# EAGLE design esploc (EAGLE 7.0.0)
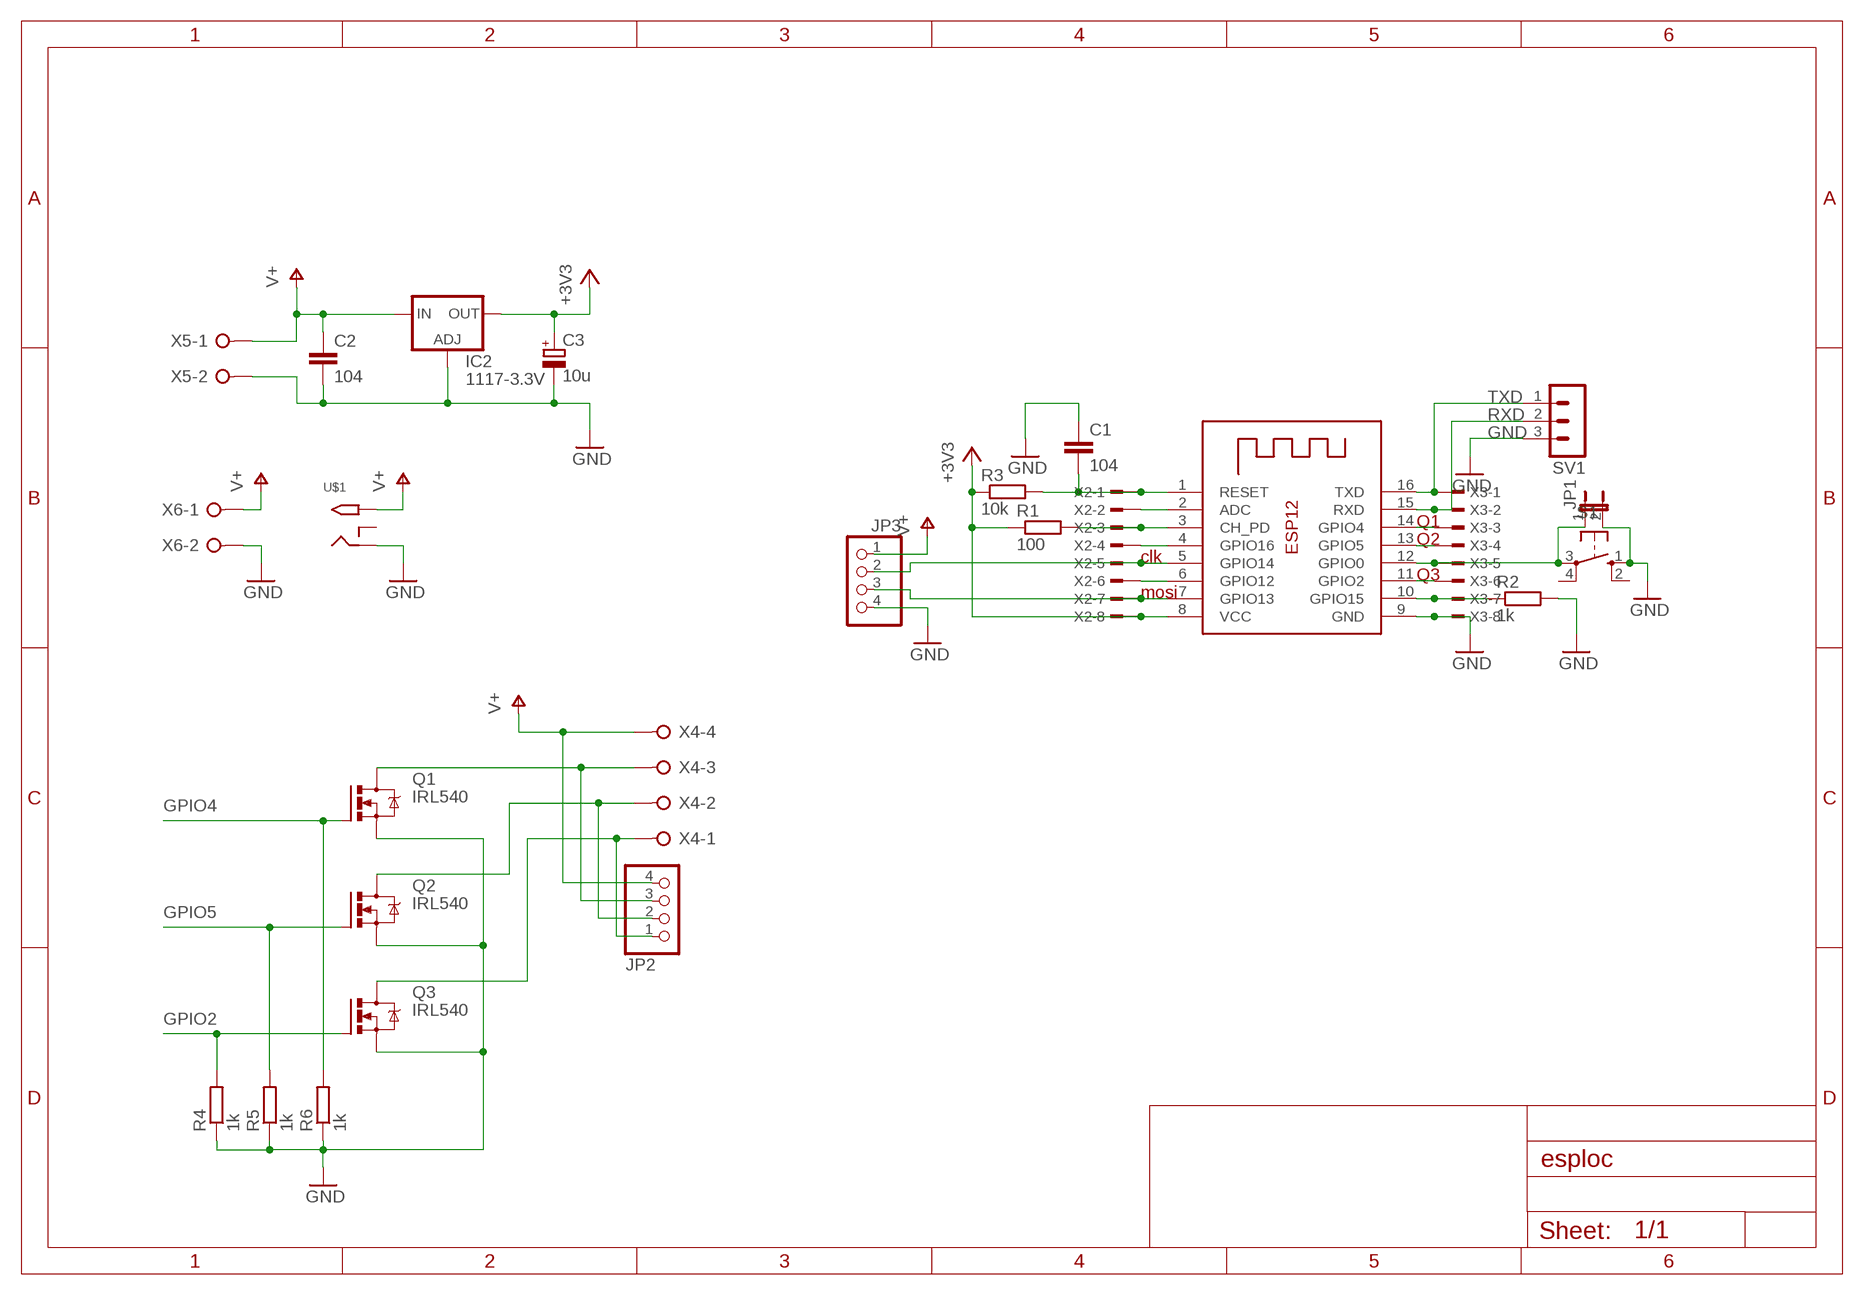
[diagram p0: schematic, sheet 1]

## Parts
C1  104  C-EU025_050-025X075  [C025_050-025X075]
C2  104  C-EU025_050-025X075  [C025_050-025X075]
C3  10u  CPOL-EUE2,5-6E  [E2,5-6E]
IC2  1117-3.3V  LD117AS33TR  [SOT223]
JP1  JP1E  [JP1]
JP2  PINHD-1X4  [1X04]
JP3  PINHD-1X4  [1X04]
Q1  IRL540  IRF540  [TO220BV]
Q2  IRL540  IRF540  [TO220BV]
Q3  IRL540  IRF540  [TO220BV]
R1  100  R-EU_M0805  [M0805]
R2  1k  R-EU_M0805  [M0805]
R3  10k  R-EU_M0805  [M0805]
R4  1k  R-EU_M0805  [M0805]
R5  1k  R-EU_M0805  [M0805]
R6  1k  R-EU_M0805  [M0805]
S1  40-XX  [B3F-40XX]
SV1  MA03-1  [MA03-1]
U$1  2.1MMJACKTHM  [PJ-102A]
X1  ESP-12  [ESP-12]
X2  TSW-108-02-S-S  [TSW-108-02-S-S]
X3  TSW-108-02-S-S  [TSW-108-02-S-S]
X4  W237-04P  [W237-4P]
X5  W237-02P  [W237-132]
X6  W237-02P  [W237-132]

## Nets
+3V3: C3.+ IC2.2(OUT) IC2.4(OUT) R1.1 R3.1 X1.8(VCC) X2.8
GND: C1.1 C2.2 C3.- IC2.1(ADJ) JP1.2 JP3.4 Q1.S Q2.S Q3.S R2.2 R4.1 R5.1 R6.1 S1.1(S) SV1.3 U$1.RING X1.9(GND) X3.8 X5.2 X6.2
GPIO2: Q3.G R4.2 X1.11(GPIO2) X3.6
GPIO4: Q1.G R6.2 X1.14(GPIO4) X3.3
GPIO5: Q2.G R5.2 X1.13(GPIO5) X3.4
GPIO12: X1.6(GPIO12) X2.6
GPIO13: JP3.3 X1.7(GPIO13) X2.7
GPIO14: JP3.2 X1.5(GPIO14) X2.5
N$2: C1.2 R3.2 X1.1(RESET) X2.1
N$3: R1.2 X1.3(CH_PD) X2.3
N$4: R2.1 X1.10(GPIO15) X3.7
N$6: X1.4(GPIO16) X2.4
N$9: JP1.1 S1.3(P) X1.12(GPIO0) X3.5
N$10: X1.2(ADC) X2.2
N$18: JP2.3 Q1.D X4.3
N$19: JP2.2 Q2.D X4.2
N$20: JP2.1 Q3.D X4.1
RXD: SV1.2 X1.15(RXD) X3.2
TXD: SV1.1 X1.16(TXD) X3.1
V+: C2.1 IC2.3(IN) JP2.4 JP3.1 U$1.TIP X4.4 X5.1 X6.1
Unconnected: S1.2(S1) S1.4(P1) U$1.RING_SW

## Notes on the sheet
- Q1
- Q2
- clk
- Q3
- mosi

## Library data of the parts
C1 C2 = rcl:C-EU: CAPACITOR, European symbol
C3 = rcl:CPOL-EU: POLARIZED CAPACITOR, European symbol
IC2 = v-reg:LD117A?*: Low drop fixed and adjustable positive voltage regulators 1 A Source: http://www.st.com/stonline/products/literature/ds/7194/ld1117axx.pdf
JP1 = jumper:JP1E: JUMPER
JP2 JP3 = pinhead:PINHD-1X4: PIN HEADER
Q1-Q3 = transistor-power:IRF540: HEXFET Power MOSFET
R1-R6 = rcl:R-EU_: RESISTOR, European symbol
S1 = switch-omron:40-XX: OMRON SWITCH; MF: OMRON COMPONENTS USA; MPN: B3F-4000; OC_FARNELL: 176434; OC_NEWARK: 36K3105
SV1 = con-lstb:MA03-1: PIN HEADER; OC_FARNELL: unknown; OC_NEWARK: unknown
U$1 = adafruit:2.1MMJACK: 2.1mm x 5.5mm THM DC jack with internal switch. Digikey part #PJ-102A, 4UCON part #05537 2.1mm x 5.5mm SMT DC jack with internal switch. Digikey part #PJ-002A-SMT, 4UCON part #03267 By microbuilder.eu & adafruit.com
X1 = adafruit:ESP-12
X2 X3 = con-samtec:TSW-108-02-S-S: THROUGH-HOLE .025" SQ POST HEADER Source: Samtec TSW.pdf; OC_FARNELL: unknown; OC_NEWARK: unknown
X4 = con-wago-508:W237-04P: WAGO SREW CLAMP; OC_FARNELL: unknown; OC_NEWARK: unknown
X5 X6 = con-wago-508:W237-02P: WAGO SREW CLAMP; OC_FARNELL: unknown; OC_NEWARK: unknown

## Board
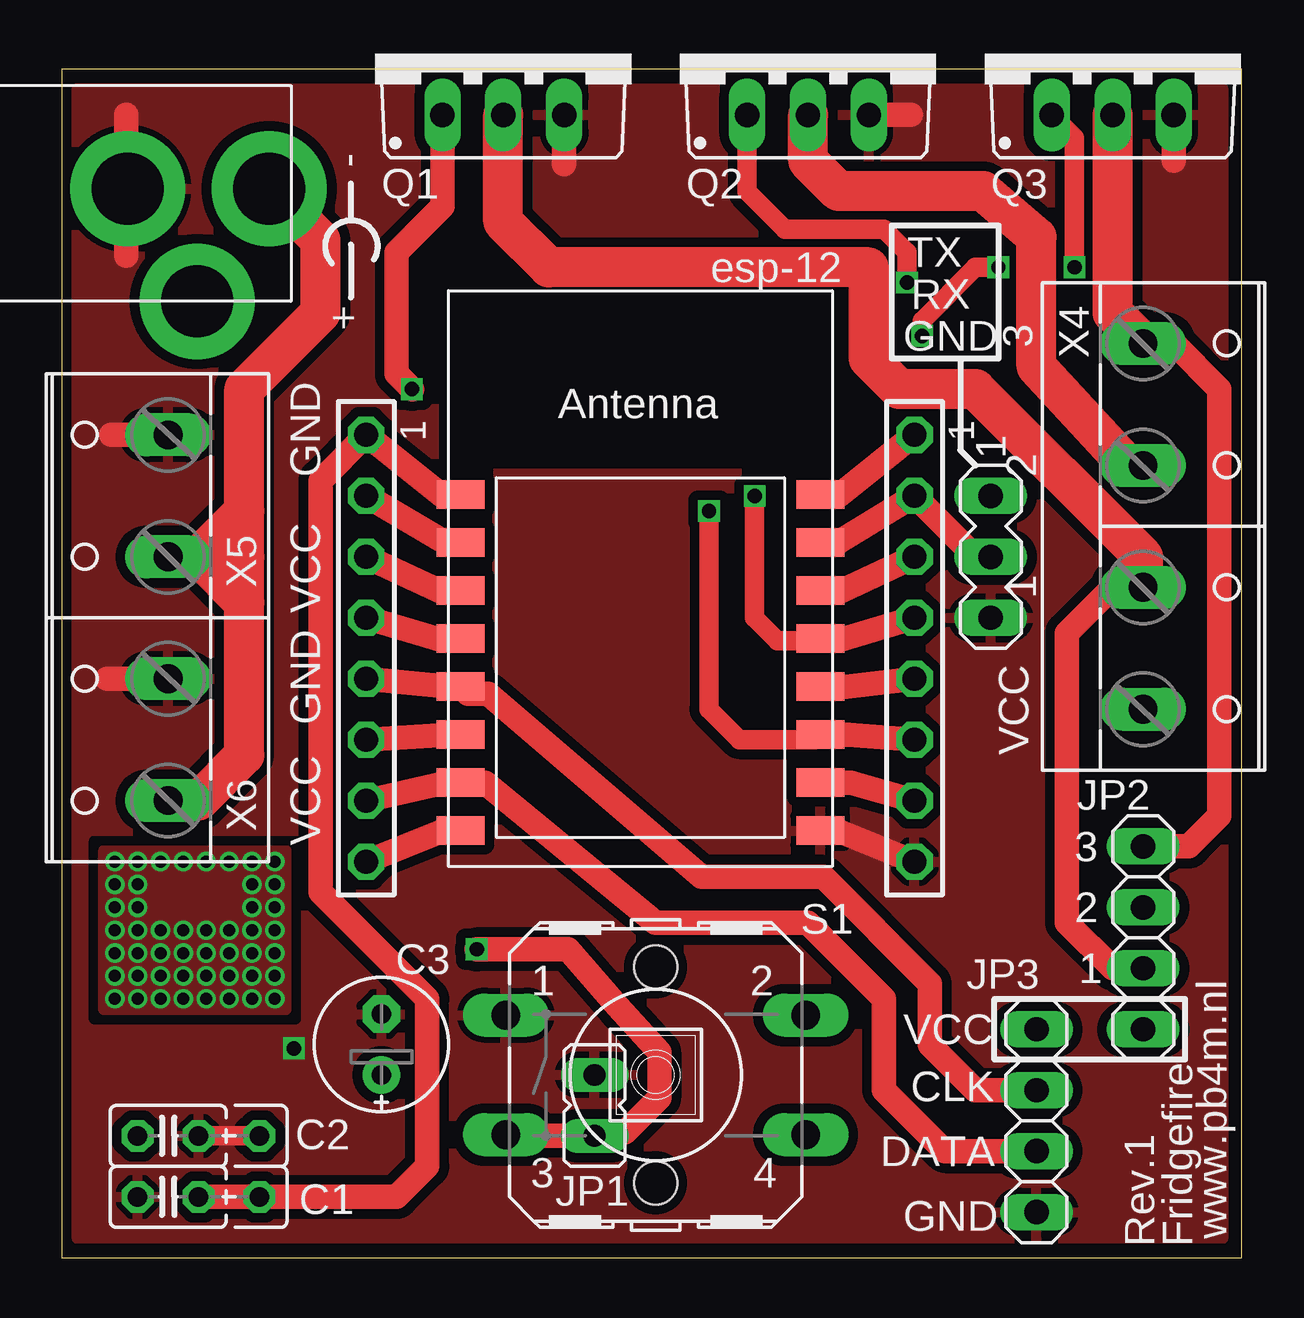
[diagram p1: board, top side]
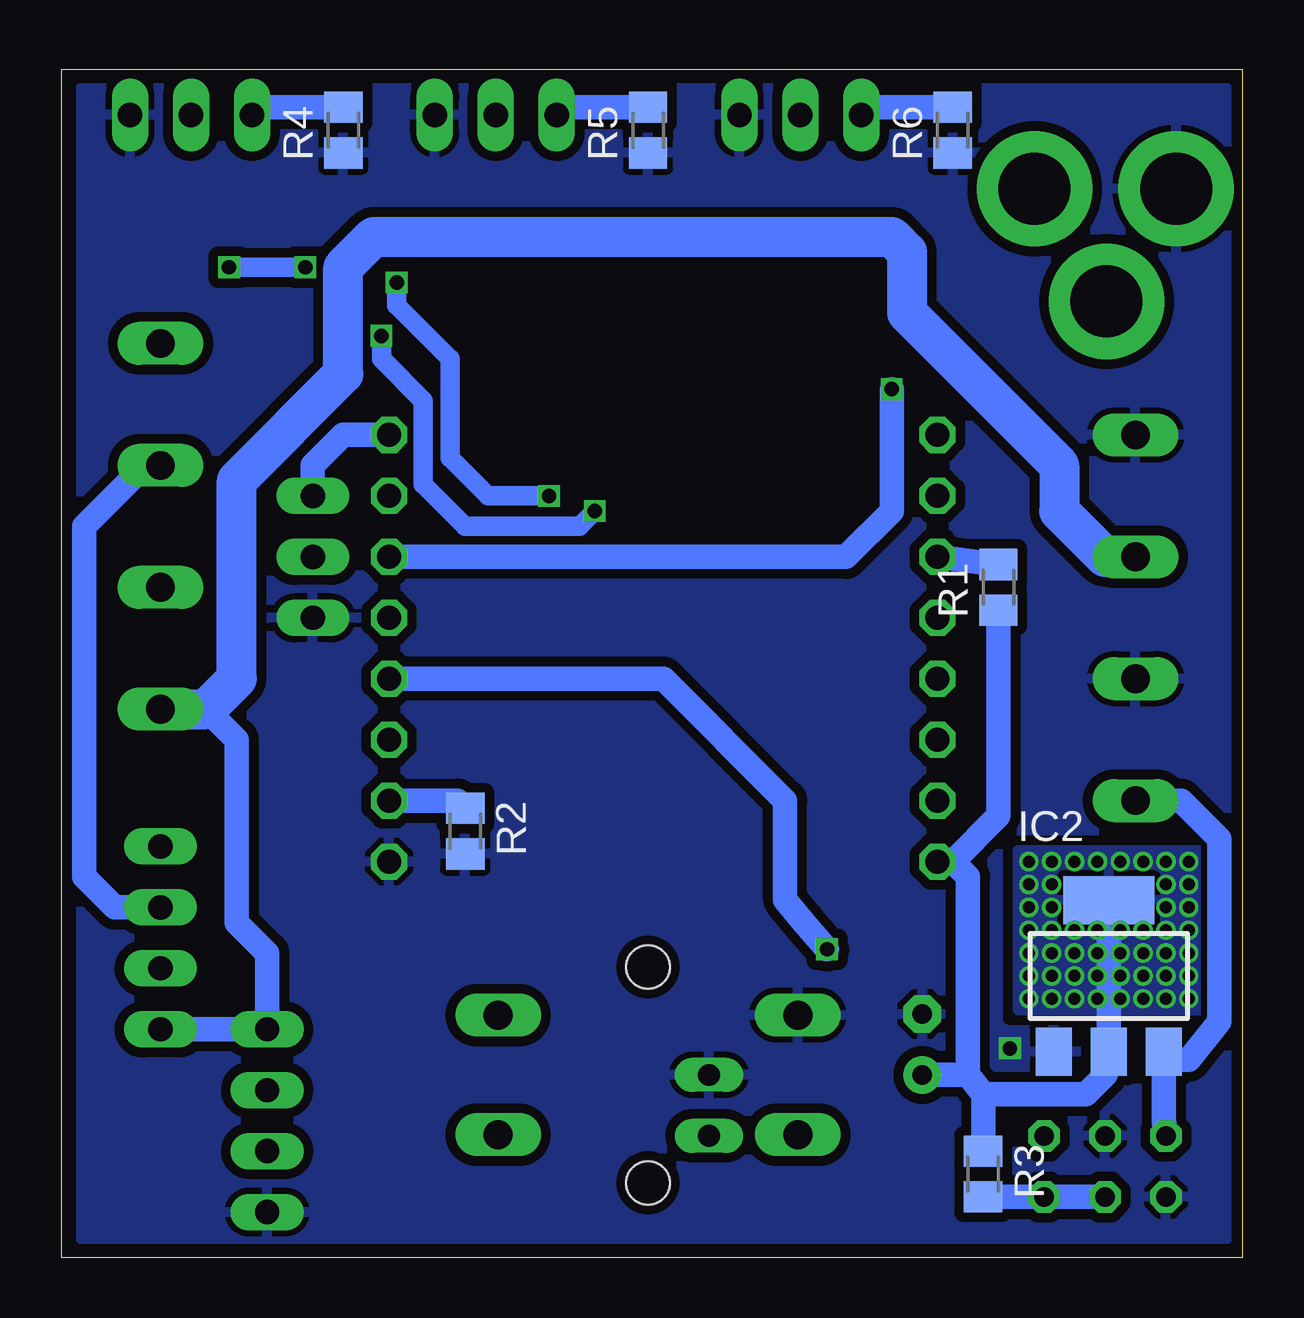
[diagram p2: board, bottom side, seen from below]

Size 49.2 x 49.52 mm. Coordinates in mm from the lower left corner, seen from the top.
Outline: 0,0 49.2,0 49.2,49.52 0,49.52 0,0
Copper layers (1*16): Top 0.035mm / dielectric 1.5mm / Bottom 0.035mm
Design rules "SeeedStudio_2layer_DRU_no_angle_20140221 *": minimum track width 6mil, minimum drill 12mil, track to track 6mil, track to pad 6mil, pad to pad 6mil, via to via 6mil, smd to smd 0mil, copper to edge 10mil, drill to drill 10mil, minimum pad ring 10mil, minimum via ring 6mil, stop-mask expansion 2mil, vias tented up to drill 100mil, thermal gap 10mil

### Footprints (pad centres in the part's own frame; a part is rotated, then mirrored left to right if it is on the bottom)
C025_050-025X075 = drill 0.813 octagon: 1 -1.27,0; 2 1.27,0; 3 3.81,0
E2,5-6E = drill 0.813 pad 1.575: + -1.27,0 | drill 0.813 pad 1.575 octagon: - 1.27,0
SOT223 = smd 1.5 x 2: 1 -2.3,-3.15; 2 0,-3.15; 3 2.3,-3.15 | smd 3.8 x 2: 4 0,3.15
JP1 = drill 0.914 long: 1 0,-1.27; 2 0,1.27
1X04 = drill 1.016 long: 1 -3.81,0; 2 -1.27,0; 3 1.27,0; 4 3.81,0
TO220BV = drill 1.016 long: D 0,-2.54; G -2.54,-2.54; S 2.54,-2.54
M0805 = smd 1.3 x 1.6: 1 -0.95,0; 2 0.95,0
B3F-40XX = drill 1.194 long: 1 -6.248,2.489; 2 6.248,2.489; 3 -6.248,-2.489; 4 6.248,-2.489 | hole 1.803: 0,-4.496; 0,4.496
MA03-1 = drill 1.016 long: 1 -2.54,0; 2 0,0; 3 2.54,0
PJ-102A = drill 3 pad 4.8: RING 0.1,-3.39; RING_SW -4.6,-6.29; TIP 0.1,-9.29
ESP-12 = smd 2 x 1.2: 1 -7.5,4.5; 2 -7.5,2.5; 3 -7.5,0.5; 4 -7.5,-1.5; 5 -7.5,-3.5; 6 -7.5,-5.5; 7 -7.5,-7.5; 8 -7.5,-9.5; 9 7.5,-9.5; 10 7.5,-7.5; 11 7.5,-5.5; 12 7.5,-3.5; 13 7.5,-1.5; 14 7.5,0.5; 15 7.5,2.5; 16 7.5,4.5
TSW-108-02-S-S = drill 1 pad 1.5 octagon: 1 8.89,0; 2 6.35,0; 3 3.81,0; 4 1.27,0; 5 -1.27,0; 6 -3.81,0; 7 -6.35,0; 8 -8.89,0
W237-4P = drill 1.194 long: 1 -7.62,-0.635; 2 -2.54,-0.635; 3 2.54,-0.635; 4 7.62,-0.635
W237-132 = drill 1.194 long: 1 -2.54,-0.635; 2 2.54,-0.635

### Placement (x,y rotation side)
C1  4.45,2.54 0 top
C2  4.45,5.08 0 top
C3  13.34,8.89 90 top
IC2  5.56,11.75 0 bottom
JP1  22.23,6.35 0 top
JP2  45.09,13.34 270 top
JP3  40.64,5.71 270 top
Q1  18.41,50.16 0 top
Q2  31.11,50.16 0 top
Q3  43.81,50.16 0 top
R1  10.16,27.94 90 bottom
R2  32.38,17.78 270 bottom
R3  10.79,3.49 270 bottom
R4  37.47,46.99 90 bottom
R5  24.77,46.99 90 bottom
R6  12.06,46.99 90 bottom
S1  24.77,7.62 0 top
SV1  38.73,29.21 270 top
U$1  -0.64,44.45 90 top
X1  24.13,27.3 0 top
X2  12.7,25.4 90 top
X3  35.56,25.4 90 top
X4  45.72,30.48 270 top
X5  3.81,31.75 90 top
X6  3.81,21.59 90 top

### Tracks (layer width: path | path; a pad name or v marks a point on that pad's centre or on a via)
+3V3  (via drill 0.5)
  Top 1.016: X1.8 15.9,17.8 X2.8
  Bottom 1.016: R1.1 10.16,18.41 12.06,16.51 | 12.06,16.51 X2.8 | R3.1 10.79,6.83 | 10.79,6.83 11.43,7.62 | 11.43,7.62 C3.+ | 10.79,6.83 6.51,6.83 5.69,7.64 5.71,7.67 IC2.2 IC2.4 | 11.43,7.62 11.43,15.88 12.06,16.51
  other vias: 2.22,16.51 3.17,16.51 4.13,16.51 5.08,16.51 6.03,16.51 6.99,16.51 7.94,16.51 8.89,16.51 8.89,15.56 7.94,15.56 3.17,15.56 2.22,15.56 2.22,14.61 3.17,14.61 7.94,14.61 8.89,14.61 8.89,13.65 7.94,13.65 6.99,13.65 6.03,13.65 5.08,13.65 4.13,13.65 3.17,13.65 2.22,13.65 2.22,12.7 3.17,12.7 4.13,12.7 5.08,12.7 6.03,12.7 6.99,12.7 7.94,12.7 8.89,12.7 8.89,11.75 7.94,11.75 6.99,11.75 6.03,11.75 5.08,11.75 4.13,11.75 3.17,11.75 2.22,11.75 2.22,10.79 3.17,10.79 4.13,10.79 5.08,10.79 6.03,10.79 6.99,10.79 7.94,10.79 8.89,10.79
  pour Bottom (isolate 0.254): 1.75,16.99 9.37,16.99 9.37,10.32 1.75,10.32
  pour Top (isolate 0.254): 1.75,16.99 9.37,16.99 9.37,10.32 1.75,10.32
GND  (via drill 0.6)
  Top 0.813: C2.2 8.26,5.08
  Top 1.016: X1.9 32.36,17.8 X3.8 | Q3.S 46.35,45.72 | Q2.S 35.4,47.62 | Q1.S 20.95,45.56 | X5.2 2.06,34.29 | X6.2 1.91,24.13 | 2.7,47.62 2.7,41.75
  other vias: 9.68,8.73
  pour Top (isolate 0.406, rank 6): 0.64,48.74 48.42,48.74 48.42,0.79 0.64,0.79
  pour Bottom (isolate 0.406, rank 6): 0.64,48.74 48.42,48.74 48.42,0.79 0.64,0.79
GPIO2  (via drill 0.6)
  Top 0.813: Q3.G 42.23,46.67 v42.23,41.27 | v39.05,41.27 38.1,41.27 35.88,39.05 v35.88,38.42 | v26.99,31.11 26.99,22.86 28.26,21.59 31.41,21.59 X1.11
  Top 1.016: X1.11 32.8,21.8 X3.6
  Bottom 0.813: v42.23,41.27 v39.05,41.27 | v35.88,38.42 35.88,37.47 34.13,35.72 34.13,32.23 32.38,30.48 27.62,30.48 v26.99,31.11
  Bottom 1.016: R4.2 40.96,47.94 Q3.G
GPIO4  (via drill 0.6)
  Top 1.016: X1.14 32.52,27.8 X3.3 | Q1.G 15.88,43.81 13.97,41.91 13.97,36.83 v14.61,36.2
  Bottom 1.016: R6.2 15.56,47.94 Q1.G | v14.61,36.2 14.61,31.11 16.51,29.21 X3.3
GPIO5  (via drill 0.6)
  Top 0.813: Q2.G 28.57,44.45 30.16,42.86 34.29,42.86 35.24,41.91 v35.24,40.64 | v28.89,31.75 28.89,26.67 29.84,25.72 31.54,25.72 X1.13
  Top 1.016: X1.13 32.62,25.8 X3.4
  Bottom 0.813: v35.24,40.64 35.24,39.69 33.02,37.47 33.02,33.34 31.43,31.75 v28.89,31.75
  Bottom 1.016: R5.2 28.26,47.95 Q2.G
GPIO12
  Top 1.016: X1.6 16.09,21.8 X2.6
GPIO13
  Top 1.016: X2.7 15.99,19.8 X1.7 17.66,19.8 24.77,13.97 31.11,13.97 34.29,10.79 34.29,6.99 36.83,4.45 JP3.3
GPIO14
  Top 1.016: X2.5 16.18,23.8 X1.5 16.94,23.5 17.78,23.5 26.67,15.88 31.75,15.88 36.2,11.43 36.2,8.89 38.1,6.99 JP3.2
N$2
  Top 1.016: X1.1 15.82,31.8 X2.1 10.79,32.38 10.79,15.24 15.24,10.79 15.24,3.81 13.97,2.54 C1.2
  Bottom 1.016: R3.2 8.57,2.54 7.94,2.54 C1.2
N$3
  Top 1.016: X1.3 15.74,27.8 X2.3
  Bottom 1.016: X2.3 R1.2
N$4
  Top 1.016: X1.10 32.9,19.8 X3.7
  Bottom 1.016: X3.7 32.7,19.05 R2.1
N$6
  Top 1.016: X1.4 15.64,25.8 X2.4
N$9  (via drill 0.6)
  Top 1.016: X1.12 32.71,23.8 X3.5 | v17.3,12.86 21.11,12.86 23.18,10.48 24.92,8.57 24.92,6.67 23.5,5.24 22.38,5.24 JP1.1 18.57,5.08 S1.3
  Bottom 1.016: v17.3,12.86 18.26,13.97 19.05,14.92 19.05,19.05 24.13,24.13 X3.5
N$10
  Top 1.016: X2.2 15.96,29.84 X1.2
N$18
  Top 1.016: X4.3 43.81,27.94 41.91,26.04 41.91,13.97 43.81,12.06 JP2.3
  Top 1.676: X4.3 45.09,29.21 38.1,36.2 34.92,36.2 33.66,37.47 33.66,41.27 20.32,41.27 18.41,43.18 Q1.D
N$19
  Top 1.676: Q2.D 31.11,45.72 32.38,44.45 38.42,44.45 40.64,42.55 40.64,37.15 44.45,33.02 X4.2
  Bottom 1.016: 45.72,33.02 48.26,30.48 48.26,15.88 46.99,14.61 JP2.2
  Bottom 1.676: 45.72,33.02 X4.2
N$20
  Top 1.016: X4.1 46.35,38.1 48.26,36.2 48.26,18.41 46.99,17.14 JP2.1
  Top 1.676: X4.1 43.81,39.37 Q3.D
RXD
  Top 1.016: X1.15 32.34,29.8 X3.2 38.1,29.21 SV1.2
TXD
  Top 1.016: X1.16 32.44,31.8 X3.1
  Bottom 1.016: SV1.1 38.73,33.02 37.47,34.29 X3.1
V+
  Top 1.676: X6.1 5.71,19.05 7.62,20.95 7.62,27.3 | 7.62,27.3 7.62,29.21 | 7.62,29.21 7.62,31.11 | 7.62,31.11 7.62,36.2 10.79,39.37 10.79,42.41 U$1.TIP | X5.1 5.71,29.21 | 5.71,29.21 7.62,29.21 | 7.62,31.11 5.71,29.21 | 5.71,29.21 7.62,27.3
  Bottom 1.016: X6.1 2.54,19.05 0.95,17.46 0.95,9.84 2.22,8.26 3.38,8.26 3.42,8.29 IC2.3 3.26,5.64 3.25,5.63 C2.1 | 43.18,22.86 41.91,21.59 41.91,13.97 40.64,12.7 JP3.1 JP2.4
  Bottom 1.676: X4.4 43.18,22.86 41.91,24.13 41.91,32.38 37.47,36.83 37.47,41.27 36.2,42.55 14.61,42.55 13.97,41.91 13.97,39.37 7.62,33.02 7.62,31.11 5.71,29.21 X5.1

### Text on the board
tNames: - | esp-12 | TX | + | RX | GND | 3 | GND | 2 | VCC | 1 | GND | VCC | VCC | 3 | 2 | 1 | VCC | CLK | DATA | GND | www.pb4m.nl | Rev.1 | Fridgefire